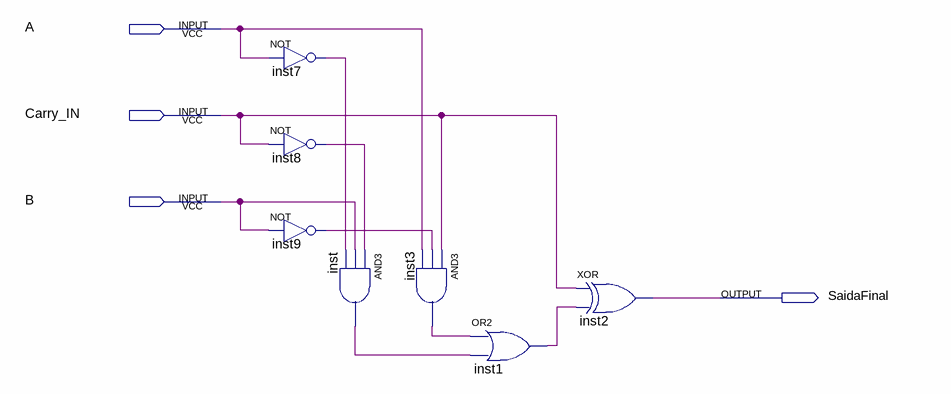
[diagram p0: schematic sheet]
// Quartus schematic Signal.bdf as structural Verilog: 7 symbols, 4 pins
module Signal (
  input  A,
  input  Carry_IN,
  input  B,
  output SaidaFinal
);

  wire inst1_out, inst3_out, inst7_out, inst8_out, inst9_out, inst_out;

  not inst7 (inst7_out, A);
  not inst8 (inst8_out, Carry_IN);
  not inst9 (inst9_out, B);
  and inst (inst_out, inst8_out, B, inst7_out);
  and inst3 (inst3_out, Carry_IN, inst9_out, A);
  or inst1 (inst1_out, inst3_out, inst_out);
  xor inst2 (SaidaFinal, Carry_IN, inst1_out);
endmodule
